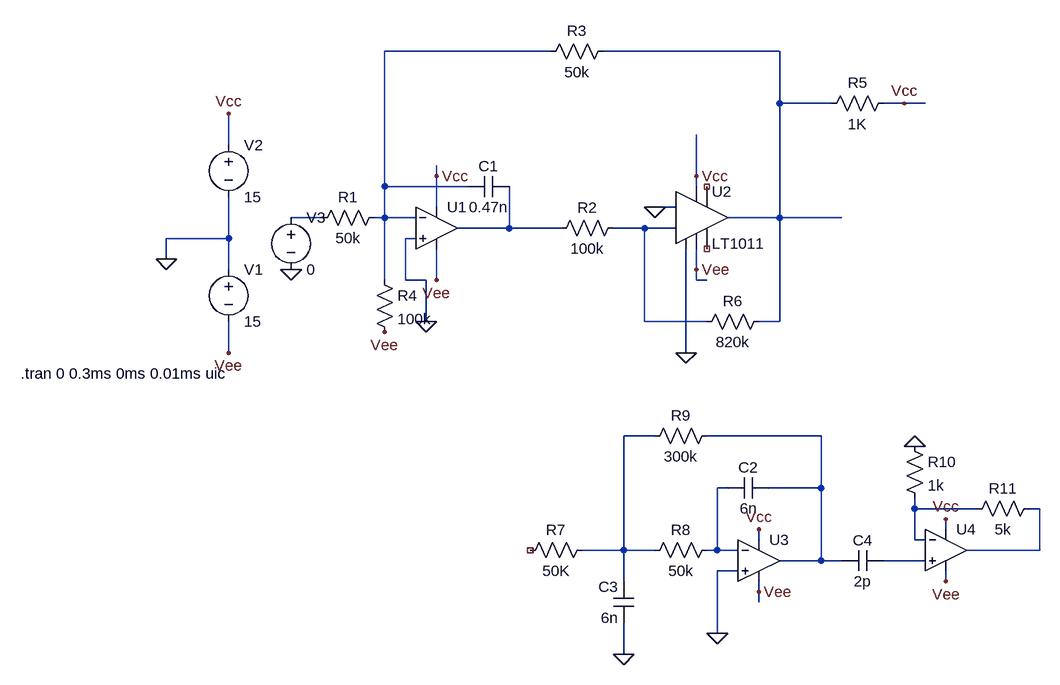
[diagram p0: schematic MLI.asc]
MLI.asc, the LTspice schematic file:
Version 4
SHEET 1 1236 960
WIRE 320 16 64 16
WIRE 672 16 400 16
WIRE 672 96 672 16
WIRE 752 96 672 96
WIRE 864 96 832 96
WIRE 896 96 864 96
WIRE -176 160 -176 112
WIRE 144 208 144 192
WIRE 544 208 544 144
WIRE 64 224 64 16
WIRE 192 224 64 224
WIRE 544 224 544 208
WIRE 144 256 144 208
WIRE 480 256 464 256
WIRE 512 256 480 256
WIRE -32 272 -80 272
WIRE 64 272 64 224
WIRE 64 272 48 272
WIRE 112 272 64 272
WIRE 672 272 672 96
WIRE 672 272 592 272
WIRE 768 272 672 272
WIRE 256 288 256 224
WIRE 256 288 176 288
WIRE 336 288 256 288
WIRE 464 288 416 288
WIRE 512 288 464 288
WIRE -176 304 -176 240
WIRE -176 304 -272 304
WIRE 112 304 96 304
WIRE -272 336 -272 304
WIRE -176 352 -176 304
WIRE 544 352 544 320
WIRE 64 368 64 272
WIRE 96 368 96 304
WIRE 128 368 96 368
WIRE 144 368 144 320
WIRE 544 368 544 352
WIRE 560 368 544 368
WIRE 128 432 128 368
WIRE 464 432 464 288
WIRE 560 432 464 432
WIRE 672 432 672 272
WIRE 672 432 640 432
WIRE -176 480 -176 432
WIRE 528 480 528 320
WIRE 480 608 432 608
WIRE 736 608 560 608
WIRE 592 688 576 688
WIRE 736 688 736 608
WIRE 736 688 656 688
WIRE 880 720 880 704
WIRE 976 720 880 720
WIRE 1072 720 1056 720
WIRE 928 752 928 736
WIRE 640 768 640 752
WIRE 880 768 880 720
WIRE 896 768 880 768
WIRE 432 784 432 608
WIRE 432 784 368 784
WIRE 480 784 432 784
WIRE 576 784 576 688
WIRE 576 784 560 784
WIRE 608 784 576 784
WIRE 1072 784 1072 720
WIRE 1072 784 960 784
WIRE 736 800 736 688
WIRE 736 800 672 800
WIRE 768 800 736 800
WIRE 896 800 832 800
WIRE 608 816 576 816
WIRE 432 832 432 784
WIRE 928 832 928 816
WIRE 640 848 640 832
WIRE 640 864 640 848
WIRE 576 912 576 816
WIRE 432 944 432 896
FLAG -176 112 Vcc
FLAG -176 480 Vee
FLAG 528 480 0
FLAG 144 368 Vee
FLAG 144 208 Vcc
FLAG 544 208 Vcc
FLAG -272 336 0
FLAG 128 432 0
FLAG 544 352 Vee
FLAG 432 944 0
FLAG 640 752 Vcc
FLAG 928 736 Vcc
FLAG 928 832 Vee
FLAG 880 624 0
FLAG 480 256 0
FLAG 576 912 0
FLAG 640 848 Vee
FLAG 864 96 Vcc
FLAG 64 448 Vee
FLAG -80 352 0
SYMBOL Opamps/UniversalOpamp2 144 288 R0
SYMATTR InstName U1
SYMBOL Comparators/LT1011 544 272 R0
SYMATTR InstName U2
SYMBOL voltage -176 336 R0
SYMATTR InstName V1
SYMATTR Value 15
SYMBOL voltage -176 144 R0
SYMATTR InstName V2
SYMATTR Value 15
SYMBOL res 64 256 R90
WINDOW 0 0 56 VBottom 2
WINDOW 3 32 56 VTop 2
SYMATTR InstName R1
SYMATTR Value 50k
SYMBOL res 432 272 R90
WINDOW 0 0 56 VBottom 2
WINDOW 3 32 56 VTop 2
SYMATTR InstName R2
SYMATTR Value 100k
SYMBOL res 416 0 R90
WINDOW 0 0 56 VBottom 2
WINDOW 3 32 56 VTop 2
SYMATTR InstName R3
SYMATTR Value 50k
SYMBOL res 736 112 R270
WINDOW 0 32 56 VTop 2
WINDOW 3 0 56 VBottom 2
SYMATTR InstName R5
SYMATTR Value 1K
SYMBOL res 656 416 R90
WINDOW 0 0 56 VBottom 2
WINDOW 3 32 56 VTop 2
SYMATTR InstName R6
SYMATTR Value 820k
SYMBOL cap 256 208 R90
WINDOW 0 0 32 VBottom 2
WINDOW 3 32 32 VTop 2
SYMATTR InstName C1
SYMATTR Value 0.47n
SYMBOL res 384 768 R90
WINDOW 0 0 56 VBottom 2
WINDOW 3 32 56 VTop 2
SYMATTR InstName R7
SYMATTR Value 50K
SYMBOL res 576 768 R90
WINDOW 0 0 56 VBottom 2
WINDOW 3 32 56 VTop 2
SYMATTR InstName R8
SYMATTR Value 50k
SYMBOL res 576 592 R90
WINDOW 0 0 56 VBottom 2
WINDOW 3 32 56 VTop 2
SYMATTR InstName R9
SYMATTR Value 300k
SYMBOL cap 656 672 R90
WINDOW 0 0 32 VBottom 2
WINDOW 3 32 32 VTop 2
SYMATTR InstName C2
SYMATTR Value 6n
SYMBOL cap 448 896 R180
WINDOW 0 24 56 Left 2
WINDOW 3 24 8 Left 2
SYMATTR InstName C3
SYMATTR Value 6n
SYMBOL Opamps/UniversalOpamp2 640 800 R0
SYMATTR InstName U3
SYMBOL Opamps/UniversalOpamp2 928 784 R0
SYMATTR InstName U4
SYMBOL res 864 608 R0
SYMATTR InstName R10
SYMATTR Value 1k
SYMBOL res 1072 704 R90
WINDOW 0 0 56 VBottom 2
WINDOW 3 32 56 VTop 2
SYMATTR InstName R11
SYMATTR Value 5k
SYMBOL cap 832 784 R90
WINDOW 0 0 32 VBottom 2
WINDOW 3 32 32 VTop 2
SYMATTR InstName C4
SYMATTR Value 2p
SYMBOL res 48 352 R0
SYMATTR InstName R4
SYMATTR Value 100k
SYMBOL voltage -80 256 R0
SYMATTR InstName V3
SYMATTR Value 0
TEXT -496 512 Left 2 !.tran 0 0.3ms 0ms 0.01ms uic

The netlist it stands for:
* MLI.asc
XU1 0 N001 Vcc Vee N004 level.2 Avol=1Meg GBW=10Meg Slew=10Meg ilimit=25m rail=0 Vos=0 phimargin=45 en=0 enk=0 in=0 ink=0 Rin=500Meg  ; pins IN+ IN- V+ V- OUT
XU2 0 N005 0 Vee NC_01 NC_02 N002 Vcc LT1011
V1 0 Vee 15
V2 Vcc 0 15
R1 N001 N003 50k
R2 N005 N004 100k
R3 N002 N001 50k
R5 N002 Vcc 1K
R6 N002 N005 820k
C1 N004 N001 0.47n
R7 N006 NC_03 50K
R8 N008 N006 50k
R9 N007 N006 300k
C2 N007 N008 6n
C3 0 N006 6n
XU3 0 N008 Vcc Vee N007 level.2 Avol=1Meg GBW=10Meg Slew=10Meg ilimit=25m rail=0 Vos=0 phimargin=45 en=0 enk=0 in=0 ink=0 Rin=500Meg  ; pins IN+ IN- V+ V- OUT
XU4 N011 N009 Vcc Vee N010 level.2 Avol=1Meg GBW=10Meg Slew=10Meg ilimit=25m rail=0 Vos=0 phimargin=45 en=0 enk=0 in=0 ink=0 Rin=500Meg  ; pins IN+ IN- V+ V- OUT
R10 0 N009 1k
R11 N010 N009 5k
C4 N011 N007 2p
R4 N001 Vee 100k
V3 N003 0 0
.tran 0 0.3ms 0ms 0.01ms uic
.lib UniversalOpamps2.sub
.lib LTC1.lib
.backanno
.end